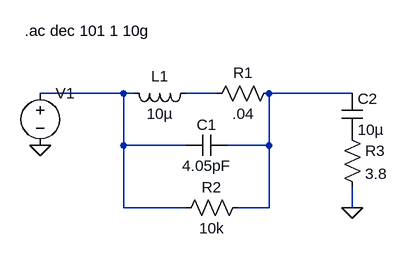
[diagram p0: schematic example.asc]
example.asc, the LTspice schematic file:
Version 4
SHEET 1 880 680
WIRE -32 128 -160 128
WIRE -16 128 -32 128
WIRE 112 128 64 128
WIRE 320 128 192 128
WIRE -32 208 -32 128
WIRE 64 208 -32 208
WIRE 192 208 192 128
WIRE 192 208 128 208
WIRE -32 304 -32 208
WIRE 64 304 -32 304
WIRE 192 304 192 208
WIRE 192 304 144 304
WIRE 320 304 320 272
FLAG -160 208 0
FLAG 320 304 0
SYMBOL voltage -160 112 R0
WINDOW 3 24 96 Invisible 2
SYMATTR InstName V1
SYMATTR Value ""
SYMATTR Value2 AC 1
SYMBOL ind 80 112 R90
WINDOW 0 5 56 VBottom 2
WINDOW 3 32 56 VTop 2
SYMATTR InstName L1
SYMATTR Value 10µ
SYMBOL res 208 112 R90
WINDOW 0 0 56 VBottom 2
WINDOW 3 32 56 VTop 2
SYMATTR InstName R1
SYMATTR Value .04
SYMBOL cap 128 192 R90
WINDOW 0 0 32 VBottom 2
WINDOW 3 32 32 VTop 2
SYMATTR InstName C1
SYMATTR Value 4.05pF
SYMBOL res 160 288 R90
WINDOW 0 0 56 VBottom 2
WINDOW 3 32 56 VTop 2
SYMATTR InstName R2
SYMATTR Value 10k
SYMBOL cap 304 128 R0
SYMATTR InstName C2
SYMATTR Value 10µ
SYMBOL res 304 176 R0
SYMATTR InstName R3
SYMATTR Value 3.8
TEXT -184 32 Left 2 !.ac dec 101 1 10g

The netlist it stands for:
* example.asc
V1 N001 0 AC 1
L1 N002 N001 10µ
R1 N003 N002 .04
C1 N003 N001 4.05pF
R2 N003 N001 10k
C2 N003 P001 10µ
R3 P001 0 3.8
.ac dec 101 1 10g
.backanno
.end